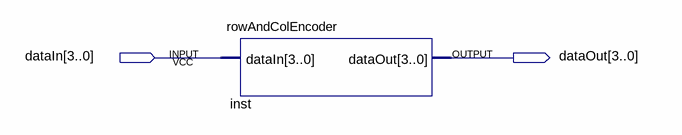
[diagram p0: schematic sheet]
// Quartus schematic testrowandcolencoder.bdf as structural Verilog: 1 symbols, 2 pins
module testrowandcolencoder (
  input  [3:0] dataIn,
  output [3:0] dataOut
);

  rowAndColEncoder inst (.dataIn(dataIn), .dataOut(dataOut));
endmodule
